# Altium schematic sheet SH9 - LEVEL SHIFTERS.SchDoc: Level Shifters
size Letter; DrawnBy: Kyle Hong; SheetNumber: 9; SheetTotal: 9
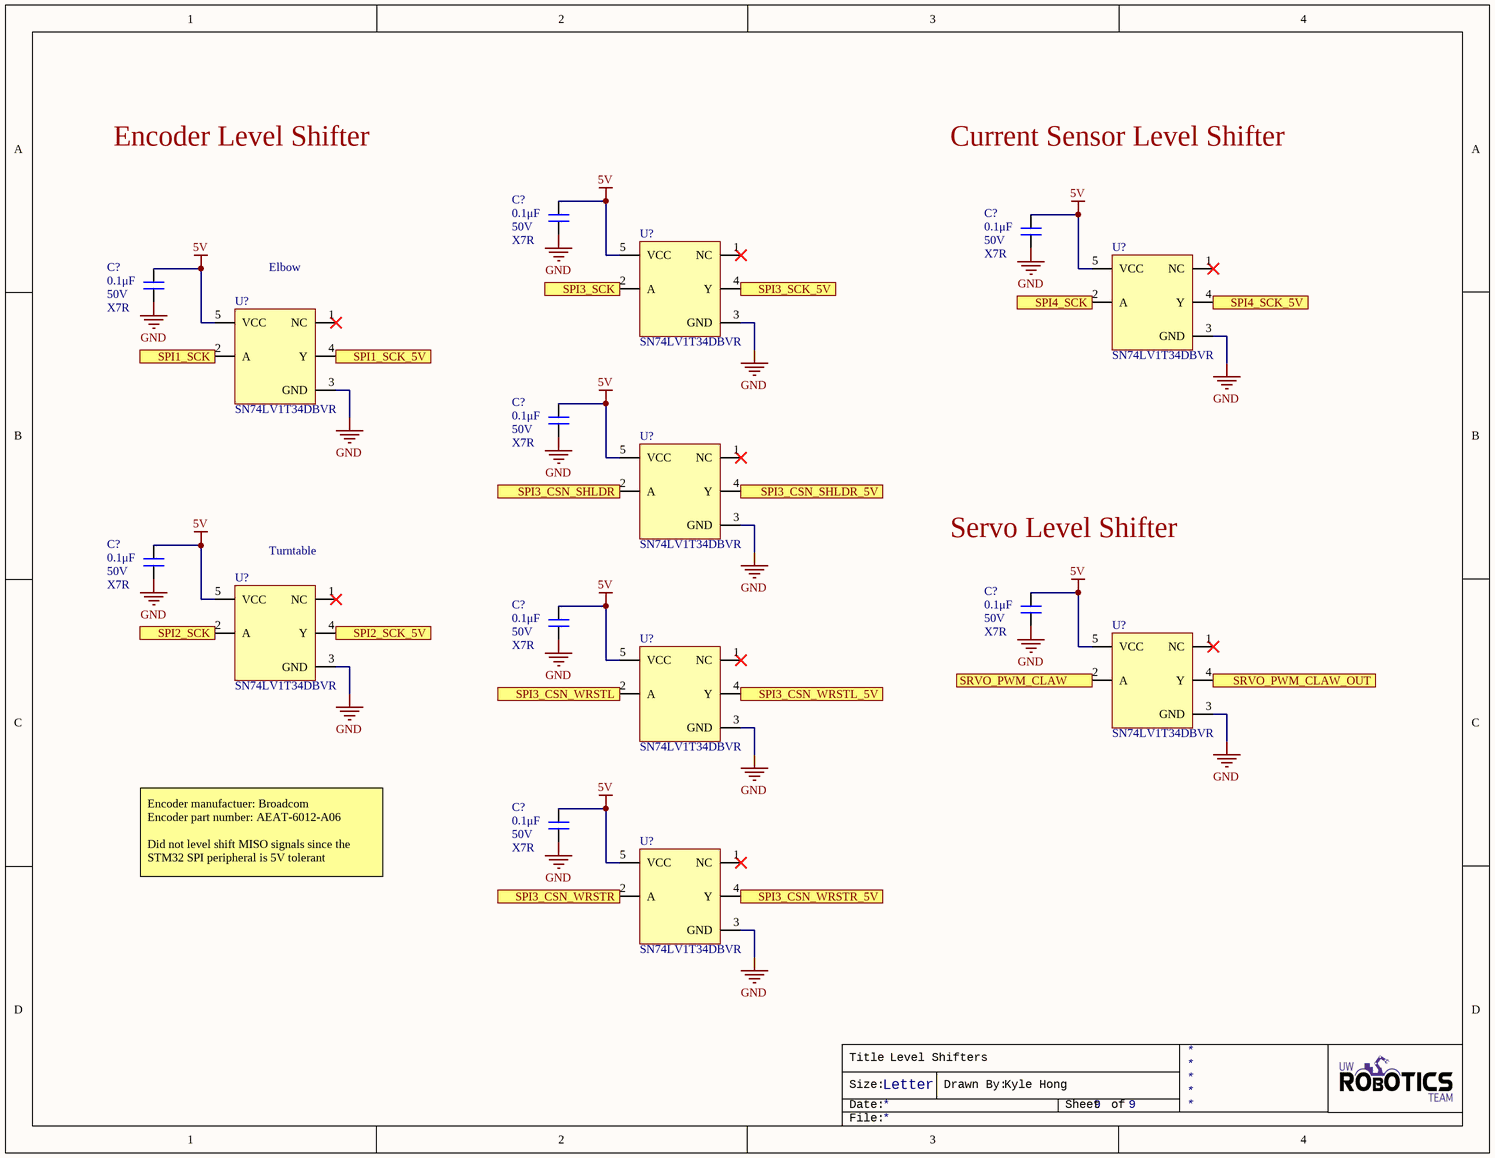
[diagram p0: SH9 - LEVEL SHIFTERS.SchDoc]

## Parts
(Parts that share a designator on the sheet are numbered #1, #2 ... from top to bottom, then left to right.)
C?#1  value 0.1μF  Dielectric: X7R  Voltage Rating: 50V  [CAP0603]  (hidden comment: CAP_0.1uF_50V_0603)
C?#2  value 0.1μF  Dielectric: X7R  Voltage Rating: 50V  [CAP0603]  (hidden comment: CAP_0.1uF_50V_0603)
C?#3  value 0.1μF  Dielectric: X7R  Voltage Rating: 50V  [CAP0603]  (hidden comment: CAP_0.1uF_50V_0603)
C?#4  value 0.1μF  Dielectric: X7R  Voltage Rating: 50V  [CAP0603]  (hidden comment: CAP_0.1uF_50V_0603)
C?#5  value 0.1μF  Dielectric: X7R  Voltage Rating: 50V  [CAP0603]  (hidden comment: CAP_0.1uF_50V_0603)
C?#6  value 0.1μF  Dielectric: X7R  Voltage Rating: 50V  [CAP0603]  (hidden comment: CAP_0.1uF_50V_0603)
C?#7  value 0.1μF  Dielectric: X7R  Voltage Rating: 50V  [CAP0603]  (hidden comment: CAP_0.1uF_50V_0603)
C?#8  value 0.1μF  Dielectric: X7R  Voltage Rating: 50V  [CAP0603]  (hidden comment: CAP_0.1uF_50V_0603)
U?#1  SN74LV1T34  [SN74LV1T34DBVR]  (value not drawn)
U?#2  SN74LV1T34  [SN74LV1T34DBVR]  (value not drawn)
U?#3  SN74LV1T34  [SN74LV1T34DBVR]  (value not drawn)
U?#4  SN74LV1T34  [SN74LV1T34DBVR]  (value not drawn)
U?#5  SN74LV1T34  [SN74LV1T34DBVR]  (value not drawn)
U?#6  SN74LV1T34  [SN74LV1T34DBVR]  (value not drawn)
U?#7  SN74LV1T34  [SN74LV1T34DBVR]  (value not drawn)
U?#8  SN74LV1T34  [SN74LV1T34DBVR]  (value not drawn)

## Ports
SPI1_SCK (in), SPI1_SCK_5V (out), SPI2_SCK (in), SPI2_SCK_5V (out), SPI3_CSN_SHLDR (in), SPI3_CSN_SHLDR_5V (out), SPI3_CSN_WRSTL (in), SPI3_CSN_WRSTL_5V (out), SPI3_CSN_WRSTR (in), SPI3_CSN_WRSTR_5V (out), SPI3_SCK (in), SPI3_SCK_5V (out), SPI4_SCK (in), SPI4_SCK_5V (out), SRVO_PWM_CLAW (in), SRVO_PWM_CLAW_OUT (out)

## Nets
5V: C?#1.2 C?#2.2 C?#3.2 C?#4.2 C?#5.2 C?#6.2 C?#7.2 C?#8.2 U?#1.5(VCC) U?#2.5(VCC) U?#3.5(VCC) U?#4.5(VCC) U?#5.5(VCC) U?#6.5(VCC) U?#7.5(VCC) U?#8.5(VCC)
GND: C?#1.1 C?#2.1 C?#3.1 C?#4.1 C?#5.1 C?#6.1 C?#7.1 C?#8.1 U?#1.3(GND) U?#2.3(GND) U?#3.3(GND) U?#4.3(GND) U?#5.3(GND) U?#6.3(GND) U?#7.3(GND) U?#8.3(GND)
SPI1_SCK: U?#3.2(A) ; port SPI1_SCK
SPI1_SCK_5V: U?#3.4(Y) ; port SPI1_SCK_5V
SPI2_SCK: U?#5.2(A) ; port SPI2_SCK
SPI2_SCK_5V: U?#5.4(Y) ; port SPI2_SCK_5V
SPI3_CSN_SHLDR: U?#4.2(A) ; port SPI3_CSN_SHLDR
SPI3_CSN_SHLDR_5V: U?#4.4(Y) ; port SPI3_CSN_SHLDR_5V
SPI3_CSN_WRSTL: U?#7.2(A) ; port SPI3_CSN_WRSTL
SPI3_CSN_WRSTL_5V: U?#7.4(Y) ; port SPI3_CSN_WRSTL_5V
SPI3_CSN_WRSTR: U?#8.2(A) ; port SPI3_CSN_WRSTR
SPI3_CSN_WRSTR_5V: U?#8.4(Y) ; port SPI3_CSN_WRSTR_5V
SPI3_SCK: U?#1.2(A) ; port SPI3_SCK
SPI3_SCK_5V: U?#1.4(Y) ; port SPI3_SCK_5V
SPI4_SCK: U?#2.2(A) ; port SPI4_SCK
SPI4_SCK_5V: U?#2.4(Y) ; port SPI4_SCK_5V
SRVO_PWM_CLAW: U?#6.2(A) ; port SRVO_PWM_CLAW
SRVO_PWM_CLAW_OUT: U?#6.4(Y) ; port SRVO_PWM_CLAW_OUT

Not connected (* = marked no-connect by the designer): U?#1 1(NC)*; U?#2 1(NC)*; U?#3 1(NC)*; U?#4 1(NC)*; U?#5 1(NC)*; U?#6 1(NC)*; U?#7 1(NC)*; U?#8 1(NC)*

## Notes on the sheet
- Encoder Level Shifter
- Current Sensor Level Shifter
- (near U?#3) Elbow
- (near U?#5) Turntable
- Servo Level Shifter
- Encoder manufactuer: Broadcom
  Encoder part number: AEAT-6012-A06
  Did not level shift MISO signals since the STM32 SPI peripheral is 5V tolerant
- Title
- Size:
- Date:
- Letter
- Drawn By:
- Sheet
- of
- File:

## Library data of the parts
C?#1-C?#8 = CAP_0.1uF_50V_0603: CAP CER 0.1UF 50V X7R 0603; Manufacturer Part Number 1: CC0603KRX7R9BB104; Manufacturer 1: Yageo; Dimensions: 0.063" L x 0.031" W (1.60mm x 0.80mm); Package: 0603 (1608 Metric); Temperature Coefficient: X7R; Supplier Part Number 1: 311-1344-1-ND; Supplier 1: Digi-Key; Mount: Surface Mount; Case Code (Imperial): 0603; Case Code (Metric): 1608
U?#1-U?#8 = SN74LV1T34: Bus Driver, LV/LV-A/LVX/H Series, 1-Func, 1-Bit, True Output, CMOS, PDSO5; Manufacturer 1: Texas Instruments; Package Body Material: Plastic; Load Capacitance (CL): 30pF; Max I(ol): 8mA; Number of Bits: 1; Number of Ports: 2; Package Equivalence Code: TSOP5/6,.11,37; Power Supplies: 3.3V; Prop. Delay@Nom-Sup: 9ns; Propagation Delay (tpd): 14.5ns; Schmitt Trigger: No; Supply Voltage-Max (Vsup): 5.5V; Supply Voltage-Min (Vsup): 1.6V; Supply Voltage-Nom (Vsup): 1.8V; Qualification Status: Not Qualified; Supplier 1: Digi-Key; RoHS: Yes; Category: Buffers, Drivers and Transceivers; Stock 1: 38219; Pricing 1: 1=0.41000, 10=0.32900, 25=0.30120, 100=0.22400, 250=0.20300, 500=0.16800, 1000=0.12600 (USD); Package Code: LSSOP; Number of Pins: 5; Terminal Finish: Nickel; Package Shape: Rectangular; Min Operating Temperature: -40°C; Max Operating Temperature: 125°C; Logic IC Type: BUS DRIVER; Moisture Sensitivity Level: 1; JESD-609 Code: e4; Number of Functions: 1; Package Style: SMALL OUTLINE, LOW PROFILE, SHRINK PITCHMeter; Packaging: Tape and Reel; Peak Reflow Temperature (Cel): 260°C; Surface Mount: Yes; Technology: CMOS; Terminal Form: Gull Wing; Terminal Position: DUAL; Output Polarity: True; JESD-30 Code: R-PDSO-G5; Length: 2.9mm; Width: 1.6mm; Height - Seated (Max): 1.45mm; Terminal Pitch: 0.95mm; Temperature Grade: AUTOMOTIVE; ComponentLink1URL: https://www.ti.com:443/lit/ds/symlink/sn74lv1t34.pdf?src-supplier=IHS+Markit; ComponentLink1Description: https://www.ti.com:443/lit/ds/symlink/sn74lv1t34.pdf?src-supplier=IHS+Markit; ComponentLink2URL: https://datasheet.ciiva.com/29634/sn74lv1t34-29634758.pdf?src-supplier=Digi-Key; ComponentLink2Description: https://datasheet.ciiva.com/29634/sn74lv1t34-29634758.pdf?src-supplier=Digi-Key; ComponentLink3URL: https://datasheet.ciiva.com/29634/sn74lv1t34-29634759.pdf?src-supplier=Digi-Key; ComponentLink3Description: https://datasheet.ciiva.com/29634/sn74lv1t34-29634759.pdf?src-supplier=Digi-Key; ComponentLink4URL: https://datasheet.ciiva.com/29634/sn74lv1t34-29634760.pdf?src-supplier=Digi-Key; ComponentLink4Description: https://datasheet.ciiva.com/29634/sn74lv1t34-29634760.pdf?src-supplier=Digi-Key; ComponentLink5URL: https://datasheet.ciiva.com/29888/sn74lv1t34-29888041.pdf?src-supplier=Avnet; ComponentLink5Description: https://datasheet.ciiva.com/29888/sn74lv1t34-29888041.pdf?src-supplier=Avnet; Supplier Part Number 1: 296-37176-1-ND; Manufacturer Part Number 1: SN74LV1T34DBVR